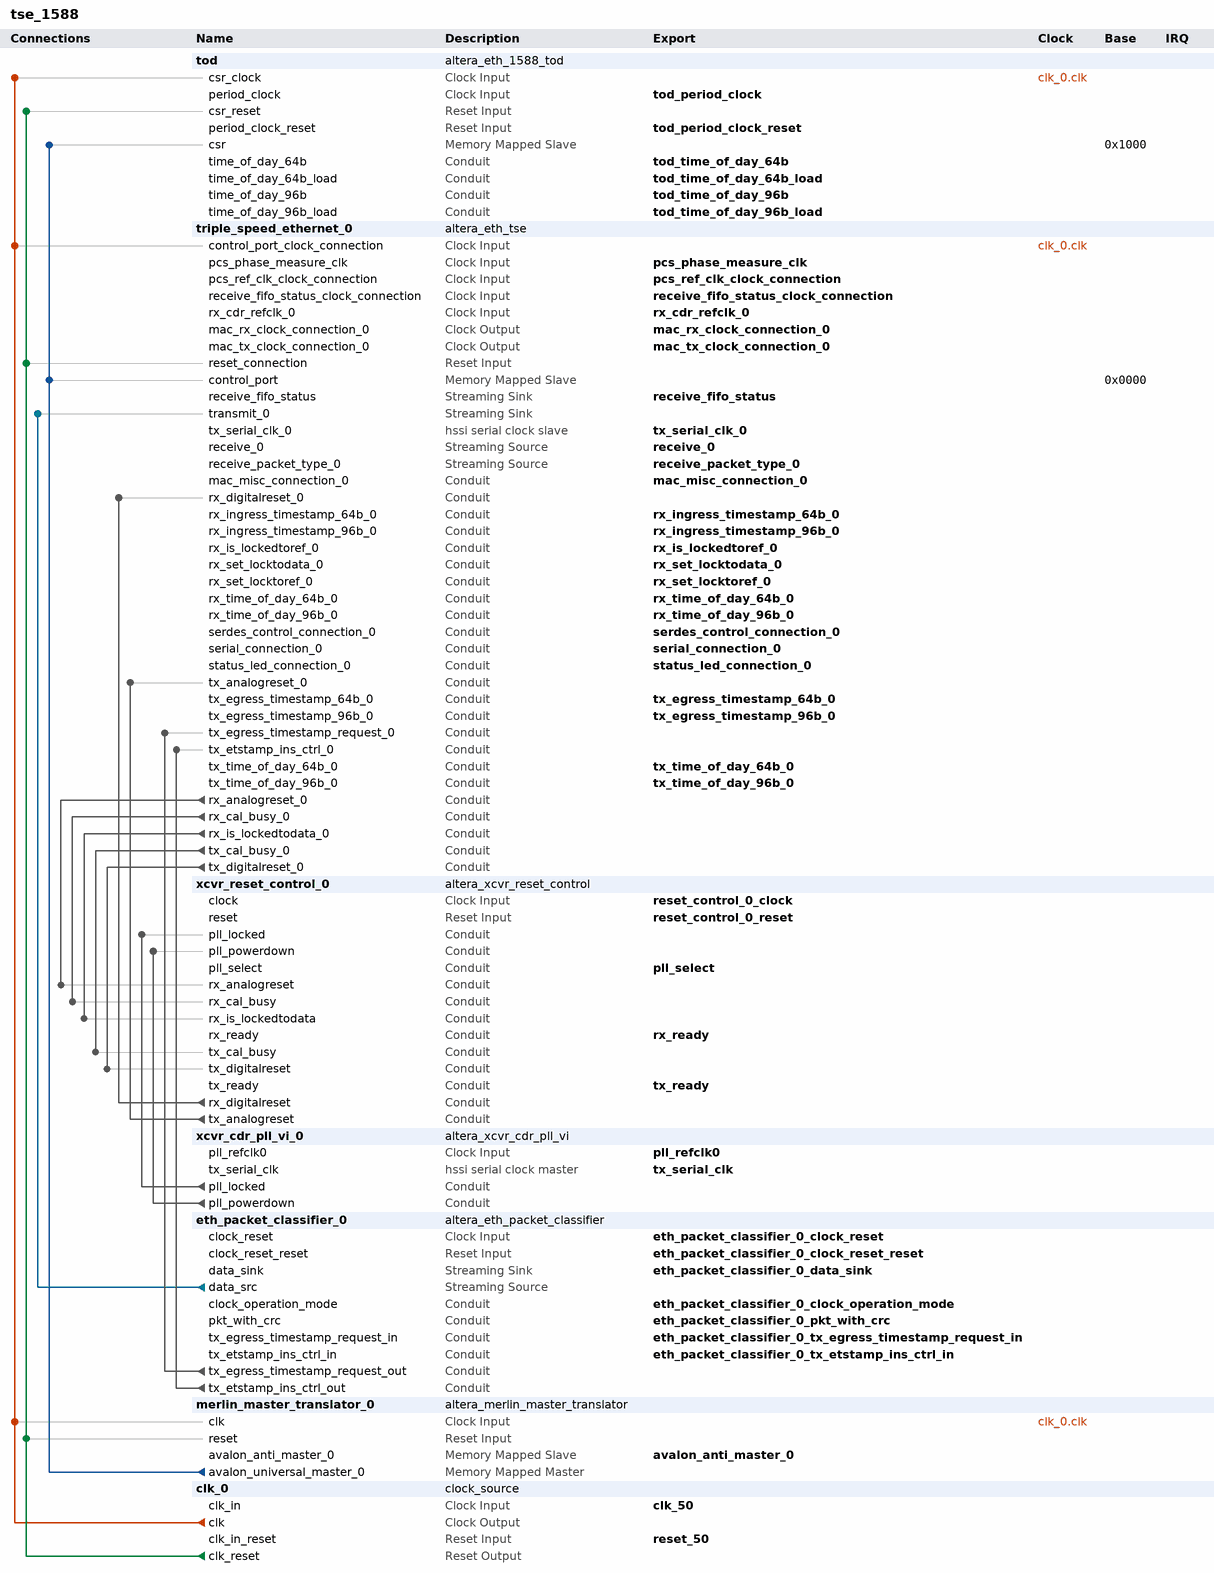
[diagram p0: system contents]
# Platform Designer (Qsys) system tse_1588, Arria 10 Unknown
# Parameters at their usual value, and those the tool derives, are not listed.
package require -exact qsys 13.1
create_system tse_1588
set_project_property DEVICE_FAMILY {Arria 10}
set_project_property DEVICE Unknown

add_instance tod altera_eth_1588_tod 13.1
set_instance_parameter_value tod DEFAULT_NSEC_PERIOD 8
set_instance_parameter_value tod DEFAULT_FNSEC_PERIOD 0
set_instance_parameter_value tod DEFAULT_NSEC_ADJPERIOD 8
set_instance_parameter_value tod DEFAULT_FNSEC_ADJPERIOD 0

add_instance triple_speed_ethernet_0 altera_eth_tse 13.1
set_instance_parameter_value triple_speed_ethernet_0 core_variation MAC_PCS
set_instance_parameter_value triple_speed_ethernet_0 ifGMII MII_GMII
set_instance_parameter_value triple_speed_ethernet_0 enable_use_internal_fifo false
set_instance_parameter_value triple_speed_ethernet_0 transceiver_type GXB
set_instance_parameter_value triple_speed_ethernet_0 enable_hd_logic true
set_instance_parameter_value triple_speed_ethernet_0 stat_cnt_ena true
set_instance_parameter_value triple_speed_ethernet_0 enable_shift16 false
set_instance_parameter_value triple_speed_ethernet_0 enable_mac_flow_ctrl true
set_instance_parameter_value triple_speed_ethernet_0 enable_magic_detect false
set_instance_parameter_value triple_speed_ethernet_0 useMDIO false
set_instance_parameter_value triple_speed_ethernet_0 mdio_clk_div 40
set_instance_parameter_value triple_speed_ethernet_0 ing_addr 11
set_instance_parameter_value triple_speed_ethernet_0 enable_sgmii true
set_instance_parameter_value triple_speed_ethernet_0 enable_timestamping true
set_instance_parameter_value triple_speed_ethernet_0 enable_ptp_1step true

add_instance xcvr_reset_control_0 altera_xcvr_reset_control 13.1
set_instance_parameter_value xcvr_reset_control_0 CHANNELS 1
set_instance_parameter_value xcvr_reset_control_0 SYS_CLK_IN_MHZ 125
set_instance_parameter_value xcvr_reset_control_0 TX_PLL_ENABLE 1
set_instance_parameter_value xcvr_reset_control_0 gui_tx_auto_reset 1
set_instance_parameter_value xcvr_reset_control_0 T_TX_DIGITALRESET 20
set_instance_parameter_value xcvr_reset_control_0 RX_PER_CHANNEL 0
set_instance_parameter_value xcvr_reset_control_0 T_RX_ANALOGRESET 40

add_instance xcvr_cdr_pll_vi_0 altera_xcvr_cdr_pll_vi 13.1
set_instance_parameter_value xcvr_cdr_pll_vi_0 rcfg_debug 0
set_instance_parameter_value xcvr_cdr_pll_vi_0 enable_pll_reconfig 0
set_instance_parameter_value xcvr_cdr_pll_vi_0 rcfg_file_prefix altera_xcvr_cdr_pll_vi
set_instance_parameter_value xcvr_cdr_pll_vi_0 rcfg_sv_file_enable 0
set_instance_parameter_value xcvr_cdr_pll_vi_0 rcfg_h_file_enable 0
set_instance_parameter_value xcvr_cdr_pll_vi_0 rcfg_txt_file_enable 0
set_instance_parameter_value xcvr_cdr_pll_vi_0 rcfg_mif_file_enable 0
set_instance_parameter_value xcvr_cdr_pll_vi_0 rcfg_multi_enable 0
set_instance_parameter_value xcvr_cdr_pll_vi_0 rcfg_profile_cnt 2
set_instance_parameter_value xcvr_cdr_pll_vi_0 rcfg_profile_select 1
set_instance_parameter_value xcvr_cdr_pll_vi_0 generate_docs 1
set_instance_parameter_value xcvr_cdr_pll_vi_0 generate_add_hdl_instance_example 0
set_instance_parameter_value xcvr_cdr_pll_vi_0 device_family {Arria 10}
set_instance_parameter_value xcvr_cdr_pll_vi_0 speed_grade dash2
set_instance_parameter_value xcvr_cdr_pll_vi_0 prot_mode basic_rx
set_instance_parameter_value xcvr_cdr_pll_vi_0 bw_sel low
set_instance_parameter_value xcvr_cdr_pll_vi_0 refclk_cnt 1
set_instance_parameter_value xcvr_cdr_pll_vi_0 refclk_index 0
set_instance_parameter_value xcvr_cdr_pll_vi_0 silicon_rev reva
set_instance_parameter_value xcvr_cdr_pll_vi_0 message_level error
set_instance_parameter_value xcvr_cdr_pll_vi_0 support_mode user_mode
set_instance_parameter_value xcvr_cdr_pll_vi_0 select_manual_config false
set_instance_parameter_value xcvr_cdr_pll_vi_0 output_clock_frequency 1250
set_instance_parameter_value xcvr_cdr_pll_vi_0 reference_clock_frequency 125.000000
set_instance_parameter_value xcvr_cdr_pll_vi_0 cdr_pll_pma_width 8
set_instance_parameter_value xcvr_cdr_pll_vi_0 cdr_pll_cgb_div 1
set_instance_parameter_value xcvr_cdr_pll_vi_0 cdr_pll_txpll_hclk_driver_enable false
set_instance_parameter_value xcvr_cdr_pll_vi_0 cdr_pll_fb_select direct_fb
set_instance_parameter_value xcvr_cdr_pll_vi_0 cdr_pll_atb_select_control atb_off
set_instance_parameter_value xcvr_cdr_pll_vi_0 cdr_pll_bbpd_data_pattern_filter_select bbpd_data_pat_off
set_instance_parameter_value xcvr_cdr_pll_vi_0 cdr_pll_cdr_odi_select sel_cdr
set_instance_parameter_value xcvr_cdr_pll_vi_0 cdr_pll_chgpmp_current_pd cp_current_pd_setting0
set_instance_parameter_value xcvr_cdr_pll_vi_0 cdr_pll_chgpmp_current_pfd cp_current_pfd_setting0
set_instance_parameter_value xcvr_cdr_pll_vi_0 cdr_pll_chgpmp_replicate true
set_instance_parameter_value xcvr_cdr_pll_vi_0 cdr_pll_chgpmp_testmode cp_test_disable
set_instance_parameter_value xcvr_cdr_pll_vi_0 cdr_pll_clklow_mux_select clklow_mux_cdr_fbclk
set_instance_parameter_value xcvr_cdr_pll_vi_0 cdr_pll_diag_loopback_enable false
set_instance_parameter_value xcvr_cdr_pll_vi_0 cdr_pll_disable_up_dn true
set_instance_parameter_value xcvr_cdr_pll_vi_0 cdr_pll_fref_clklow_div 1
set_instance_parameter_value xcvr_cdr_pll_vi_0 cdr_pll_fref_mux_select fref_mux_cdr_refclk
set_instance_parameter_value xcvr_cdr_pll_vi_0 cdr_pll_gpon_lck2ref_control gpon_lck2ref_off
set_instance_parameter_value xcvr_cdr_pll_vi_0 cdr_pll_lck2ref_delay_control lck2ref_delay_off
set_instance_parameter_value xcvr_cdr_pll_vi_0 cdr_pll_lf_resistor_pd lf_pd_setting0
set_instance_parameter_value xcvr_cdr_pll_vi_0 cdr_pll_lf_resistor_pfd lf_pfd_setting0
set_instance_parameter_value xcvr_cdr_pll_vi_0 cdr_pll_lf_ripple_cap lf_no_ripple
set_instance_parameter_value xcvr_cdr_pll_vi_0 cdr_pll_loop_filter_bias_select lpflt_bias_off
set_instance_parameter_value xcvr_cdr_pll_vi_0 cdr_pll_loopback_mode loopback_disabled
set_instance_parameter_value xcvr_cdr_pll_vi_0 cdr_pll_ltd_ltr_micro_controller_select ltd_ltr_pcs
set_instance_parameter_value xcvr_cdr_pll_vi_0 cdr_pll_op_mode pwr_down
set_instance_parameter_value xcvr_cdr_pll_vi_0 cdr_pll_pd_fastlock_mode false
set_instance_parameter_value xcvr_cdr_pll_vi_0 cdr_pll_power_mode low_power
set_instance_parameter_value xcvr_cdr_pll_vi_0 cdr_pll_reverse_serial_loopback no_loopback
set_instance_parameter_value xcvr_cdr_pll_vi_0 cdr_pll_set_cdr_v2i_enable true
set_instance_parameter_value xcvr_cdr_pll_vi_0 cdr_pll_set_cdr_vco_reset false
set_instance_parameter_value xcvr_cdr_pll_vi_0 cdr_pll_set_cdr_vco_speed cdr_vco_max_speedbin
set_instance_parameter_value xcvr_cdr_pll_vi_0 cdr_pll_set_cdr_vco_speed_pciegen3 cdr_vco_max_speedbin_pciegen3
set_instance_parameter_value xcvr_cdr_pll_vi_0 cdr_pll_vco_overrange_voltage vco_overrange_off
set_instance_parameter_value xcvr_cdr_pll_vi_0 cdr_pll_vco_underrange_voltage vco_underange_off
set_instance_parameter_value xcvr_cdr_pll_vi_0 cdr_pll_is_cascaded_pll false
set_instance_parameter_value xcvr_cdr_pll_vi_0 cdr_pll_device_variant device1
set_instance_parameter_value xcvr_cdr_pll_vi_0 cdr_pll_optimal true
set_instance_parameter_value xcvr_cdr_pll_vi_0 cdr_pll_position position_unknown
set_instance_parameter_value xcvr_cdr_pll_vi_0 cdr_pll_primary_use cmu
set_instance_parameter_value xcvr_cdr_pll_vi_0 cdr_pll_side side_unknown
set_instance_parameter_value xcvr_cdr_pll_vi_0 cdr_pll_sup_mode user_mode
set_instance_parameter_value xcvr_cdr_pll_vi_0 cdr_pll_top_or_bottom tb_unknown
set_instance_parameter_value xcvr_cdr_pll_vi_0 pma_cdr_refclk_select_mux_inclk0_logical_to_physical_mapping ref_iqclk0
set_instance_parameter_value xcvr_cdr_pll_vi_0 pma_cdr_refclk_select_mux_inclk1_logical_to_physical_mapping ref_iqclk1
set_instance_parameter_value xcvr_cdr_pll_vi_0 pma_cdr_refclk_select_mux_inclk2_logical_to_physical_mapping ref_iqclk2
set_instance_parameter_value xcvr_cdr_pll_vi_0 pma_cdr_refclk_select_mux_inclk3_logical_to_physical_mapping ref_iqclk3
set_instance_parameter_value xcvr_cdr_pll_vi_0 pma_cdr_refclk_select_mux_inclk4_logical_to_physical_mapping ref_iqclk4

add_instance eth_packet_classifier_0 altera_eth_packet_classifier 13.1
set_instance_parameter_value eth_packet_classifier_0 TSTAMP_FP_WIDTH 4
set_instance_parameter_value eth_packet_classifier_0 SYMBOLSPERBEAT 1
set_instance_parameter_value eth_packet_classifier_0 BITSPERSYMBOL 8

add_instance merlin_master_translator_0 altera_merlin_master_translator 13.1
set_instance_parameter_value merlin_master_translator_0 AV_ADDRESS_W 32
set_instance_parameter_value merlin_master_translator_0 AV_DATA_W 32
set_instance_parameter_value merlin_master_translator_0 AV_BURSTCOUNT_W 3
set_instance_parameter_value merlin_master_translator_0 AV_BYTEENABLE_W 4
set_instance_parameter_value merlin_master_translator_0 UAV_ADDRESS_W 32
set_instance_parameter_value merlin_master_translator_0 UAV_BURSTCOUNT_W 3
set_instance_parameter_value merlin_master_translator_0 AV_READLATENCY 0
set_instance_parameter_value merlin_master_translator_0 AV_WRITE_WAIT 0
set_instance_parameter_value merlin_master_translator_0 AV_READ_WAIT 0
set_instance_parameter_value merlin_master_translator_0 AV_DATA_HOLD 0
set_instance_parameter_value merlin_master_translator_0 AV_SETUP_WAIT 0
set_instance_parameter_value merlin_master_translator_0 USE_READDATA 1
set_instance_parameter_value merlin_master_translator_0 USE_WRITEDATA 1
set_instance_parameter_value merlin_master_translator_0 USE_READ 1
set_instance_parameter_value merlin_master_translator_0 USE_WRITE 1
set_instance_parameter_value merlin_master_translator_0 USE_BEGINBURSTTRANSFER 0
set_instance_parameter_value merlin_master_translator_0 USE_BEGINTRANSFER 0
set_instance_parameter_value merlin_master_translator_0 USE_BYTEENABLE 0
set_instance_parameter_value merlin_master_translator_0 USE_CHIPSELECT 0
set_instance_parameter_value merlin_master_translator_0 USE_ADDRESS 1
set_instance_parameter_value merlin_master_translator_0 USE_BURSTCOUNT 0
set_instance_parameter_value merlin_master_translator_0 USE_DEBUGACCESS 0
set_instance_parameter_value merlin_master_translator_0 USE_CLKEN 0
set_instance_parameter_value merlin_master_translator_0 USE_READDATAVALID 0
set_instance_parameter_value merlin_master_translator_0 USE_WAITREQUEST 1
set_instance_parameter_value merlin_master_translator_0 USE_LOCK 0
set_instance_parameter_value merlin_master_translator_0 USE_READRESPONSE 0
set_instance_parameter_value merlin_master_translator_0 USE_WRITERESPONSE 0
set_instance_parameter_value merlin_master_translator_0 AV_SYMBOLS_PER_WORD 4
set_instance_parameter_value merlin_master_translator_0 AV_ADDRESS_SYMBOLS 1
set_instance_parameter_value merlin_master_translator_0 AV_BURSTCOUNT_SYMBOLS 1
set_instance_parameter_value merlin_master_translator_0 AV_CONSTANT_BURST_BEHAVIOR 0
set_instance_parameter_value merlin_master_translator_0 UAV_CONSTANT_BURST_BEHAVIOR 0
set_instance_parameter_value merlin_master_translator_0 AV_LINEWRAPBURSTS 0
set_instance_parameter_value merlin_master_translator_0 AV_MAX_PENDING_READ_TRANSACTIONS 64
set_instance_parameter_value merlin_master_translator_0 AV_BURSTBOUNDARIES 0
set_instance_parameter_value merlin_master_translator_0 AV_INTERLEAVEBURSTS 0
set_instance_parameter_value merlin_master_translator_0 AV_BITS_PER_SYMBOL 8
set_instance_parameter_value merlin_master_translator_0 AV_ISBIGENDIAN 0
set_instance_parameter_value merlin_master_translator_0 AV_ADDRESSGROUP 0
set_instance_parameter_value merlin_master_translator_0 UAV_ADDRESSGROUP 0
set_instance_parameter_value merlin_master_translator_0 AV_REGISTEROUTGOINGSIGNALS 0
set_instance_parameter_value merlin_master_translator_0 AV_REGISTERINCOMINGSIGNALS 0
set_instance_parameter_value merlin_master_translator_0 AV_ALWAYSBURSTMAXBURST 0

add_instance clk_0 clock_source 13.1
set_instance_parameter_value clk_0 clockFrequency 50000000

# connections
add_connection clk_0.clk merlin_master_translator_0.clk clock
add_connection clk_0.clk tod.csr_clock clock
add_connection clk_0.clk triple_speed_ethernet_0.control_port_clock_connection clock
add_connection clk_0.clk_reset merlin_master_translator_0.reset reset
add_connection clk_0.clk_reset tod.csr_reset reset
add_connection clk_0.clk_reset triple_speed_ethernet_0.reset_connection reset
add_connection merlin_master_translator_0.avalon_universal_master_0 tod.csr avalon
set_connection_parameter_value merlin_master_translator_0.avalon_universal_master_0/tod.csr baseAddress 0x1000
add_connection merlin_master_translator_0.avalon_universal_master_0 triple_speed_ethernet_0.control_port avalon
set_connection_parameter_value merlin_master_translator_0.avalon_universal_master_0/triple_speed_ethernet_0.control_port baseAddress 0x0000
add_connection eth_packet_classifier_0.data_src triple_speed_ethernet_0.transmit_0 avalon_streaming
add_connection eth_packet_classifier_0.tx_egress_timestamp_request_out triple_speed_ethernet_0.tx_egress_timestamp_request_0 conduit
add_connection eth_packet_classifier_0.tx_etstamp_ins_ctrl_out triple_speed_ethernet_0.tx_etstamp_ins_ctrl_0 conduit
add_connection triple_speed_ethernet_0.rx_analogreset_0 xcvr_reset_control_0.rx_analogreset conduit
add_connection triple_speed_ethernet_0.rx_cal_busy_0 xcvr_reset_control_0.rx_cal_busy conduit
add_connection triple_speed_ethernet_0.rx_is_lockedtodata_0 xcvr_reset_control_0.rx_is_lockedtodata conduit
add_connection triple_speed_ethernet_0.tx_cal_busy_0 xcvr_reset_control_0.tx_cal_busy conduit
add_connection triple_speed_ethernet_0.tx_digitalreset_0 xcvr_reset_control_0.tx_digitalreset conduit
add_connection xcvr_cdr_pll_vi_0.pll_locked xcvr_reset_control_0.pll_locked conduit
add_connection xcvr_cdr_pll_vi_0.pll_powerdown xcvr_reset_control_0.pll_powerdown conduit
add_connection xcvr_reset_control_0.rx_digitalreset triple_speed_ethernet_0.rx_digitalreset_0 conduit
add_connection xcvr_reset_control_0.tx_analogreset triple_speed_ethernet_0.tx_analogreset_0 conduit

# exported interfaces
add_interface tod_period_clock clock sink
set_interface_property tod_period_clock EXPORT_OF tod.period_clock
add_interface tod_period_clock_reset reset sink
set_interface_property tod_period_clock_reset EXPORT_OF tod.period_clock_reset
add_interface receive_fifo_status_clock_connection clock sink
set_interface_property receive_fifo_status_clock_connection EXPORT_OF triple_speed_ethernet_0.receive_fifo_status_clock_connection
add_interface receive_fifo_status avalon_streaming sink
set_interface_property receive_fifo_status EXPORT_OF triple_speed_ethernet_0.receive_fifo_status
add_interface mac_rx_clock_connection_0 clock source
set_interface_property mac_rx_clock_connection_0 EXPORT_OF triple_speed_ethernet_0.mac_rx_clock_connection_0
add_interface mac_tx_clock_connection_0 clock source
set_interface_property mac_tx_clock_connection_0 EXPORT_OF triple_speed_ethernet_0.mac_tx_clock_connection_0
add_interface receive_0 avalon_streaming source
set_interface_property receive_0 EXPORT_OF triple_speed_ethernet_0.receive_0
add_interface receive_packet_type_0 avalon_streaming source
set_interface_property receive_packet_type_0 EXPORT_OF triple_speed_ethernet_0.receive_packet_type_0
add_interface rx_ingress_timestamp_96b_0 conduit end
set_interface_property rx_ingress_timestamp_96b_0 EXPORT_OF triple_speed_ethernet_0.rx_ingress_timestamp_96b_0
add_interface rx_ingress_timestamp_64b_0 conduit end
set_interface_property rx_ingress_timestamp_64b_0 EXPORT_OF triple_speed_ethernet_0.rx_ingress_timestamp_64b_0
add_interface tx_egress_timestamp_96b_0 conduit end
set_interface_property tx_egress_timestamp_96b_0 EXPORT_OF triple_speed_ethernet_0.tx_egress_timestamp_96b_0
add_interface tx_egress_timestamp_64b_0 conduit end
set_interface_property tx_egress_timestamp_64b_0 EXPORT_OF triple_speed_ethernet_0.tx_egress_timestamp_64b_0
add_interface pcs_phase_measure_clk clock sink
set_interface_property pcs_phase_measure_clk EXPORT_OF triple_speed_ethernet_0.pcs_phase_measure_clk
add_interface mac_misc_connection_0 conduit end
set_interface_property mac_misc_connection_0 EXPORT_OF triple_speed_ethernet_0.mac_misc_connection_0
add_interface pcs_ref_clk_clock_connection clock sink
set_interface_property pcs_ref_clk_clock_connection EXPORT_OF triple_speed_ethernet_0.pcs_ref_clk_clock_connection
add_interface status_led_connection_0 conduit end
set_interface_property status_led_connection_0 EXPORT_OF triple_speed_ethernet_0.status_led_connection_0
add_interface serdes_control_connection_0 conduit end
set_interface_property serdes_control_connection_0 EXPORT_OF triple_speed_ethernet_0.serdes_control_connection_0
add_interface serial_connection_0 conduit end
set_interface_property serial_connection_0 EXPORT_OF triple_speed_ethernet_0.serial_connection_0
add_interface tod_time_of_day_96b_load conduit end
set_interface_property tod_time_of_day_96b_load EXPORT_OF tod.time_of_day_96b_load
add_interface tod_time_of_day_64b_load conduit end
set_interface_property tod_time_of_day_64b_load EXPORT_OF tod.time_of_day_64b_load
add_interface reset_control_0_clock clock sink
set_interface_property reset_control_0_clock EXPORT_OF xcvr_reset_control_0.clock
add_interface rx_set_locktodata_0 conduit end
set_interface_property rx_set_locktodata_0 EXPORT_OF triple_speed_ethernet_0.rx_set_locktodata_0
add_interface rx_set_locktoref_0 conduit end
set_interface_property rx_set_locktoref_0 EXPORT_OF triple_speed_ethernet_0.rx_set_locktoref_0
add_interface rx_is_lockedtoref_0 conduit end
set_interface_property rx_is_lockedtoref_0 EXPORT_OF triple_speed_ethernet_0.rx_is_lockedtoref_0
add_interface tx_ready conduit end
set_interface_property tx_ready EXPORT_OF xcvr_reset_control_0.tx_ready
add_interface pll_select conduit end
set_interface_property pll_select EXPORT_OF xcvr_reset_control_0.pll_select
add_interface rx_ready conduit end
set_interface_property rx_ready EXPORT_OF xcvr_reset_control_0.rx_ready
add_interface pll_refclk0 clock sink
set_interface_property pll_refclk0 EXPORT_OF xcvr_cdr_pll_vi_0.pll_refclk0
add_interface tx_serial_clk hssi_serial_clock start
set_interface_property tx_serial_clk EXPORT_OF xcvr_cdr_pll_vi_0.tx_serial_clk
add_interface tx_serial_clk_0 hssi_serial_clock end
set_interface_property tx_serial_clk_0 EXPORT_OF triple_speed_ethernet_0.tx_serial_clk_0
add_interface rx_cdr_refclk_0 clock sink
set_interface_property rx_cdr_refclk_0 EXPORT_OF triple_speed_ethernet_0.rx_cdr_refclk_0
add_interface reset_control_0_reset reset sink
set_interface_property reset_control_0_reset EXPORT_OF xcvr_reset_control_0.reset
add_interface clk_50 clock sink
set_interface_property clk_50 EXPORT_OF clk_0.clk_in
add_interface reset_50 reset sink
set_interface_property reset_50 EXPORT_OF clk_0.clk_in_reset
add_interface tod_time_of_day_96b conduit end
set_interface_property tod_time_of_day_96b EXPORT_OF tod.time_of_day_96b
add_interface tod_time_of_day_64b conduit end
set_interface_property tod_time_of_day_64b EXPORT_OF tod.time_of_day_64b
add_interface avalon_anti_master_0 avalon slave
set_interface_property avalon_anti_master_0 EXPORT_OF merlin_master_translator_0.avalon_anti_master_0
add_interface eth_packet_classifier_0_clock_reset clock sink
set_interface_property eth_packet_classifier_0_clock_reset EXPORT_OF eth_packet_classifier_0.clock_reset
add_interface eth_packet_classifier_0_clock_reset_reset reset sink
set_interface_property eth_packet_classifier_0_clock_reset_reset EXPORT_OF eth_packet_classifier_0.clock_reset_reset
add_interface eth_packet_classifier_0_data_sink avalon_streaming sink
set_interface_property eth_packet_classifier_0_data_sink EXPORT_OF eth_packet_classifier_0.data_sink
add_interface eth_packet_classifier_0_clock_operation_mode conduit end
set_interface_property eth_packet_classifier_0_clock_operation_mode EXPORT_OF eth_packet_classifier_0.clock_operation_mode
add_interface eth_packet_classifier_0_pkt_with_crc conduit end
set_interface_property eth_packet_classifier_0_pkt_with_crc EXPORT_OF eth_packet_classifier_0.pkt_with_crc
add_interface eth_packet_classifier_0_tx_egress_timestamp_request_in conduit end
set_interface_property eth_packet_classifier_0_tx_egress_timestamp_request_in EXPORT_OF eth_packet_classifier_0.tx_egress_timestamp_request_in
add_interface eth_packet_classifier_0_tx_etstamp_ins_ctrl_in conduit end
set_interface_property eth_packet_classifier_0_tx_etstamp_ins_ctrl_in EXPORT_OF eth_packet_classifier_0.tx_etstamp_ins_ctrl_in
add_interface rx_time_of_day_96b_0 conduit end
set_interface_property rx_time_of_day_96b_0 EXPORT_OF triple_speed_ethernet_0.rx_time_of_day_96b_0
add_interface rx_time_of_day_64b_0 conduit end
set_interface_property rx_time_of_day_64b_0 EXPORT_OF triple_speed_ethernet_0.rx_time_of_day_64b_0
add_interface tx_time_of_day_96b_0 conduit end
set_interface_property tx_time_of_day_96b_0 EXPORT_OF triple_speed_ethernet_0.tx_time_of_day_96b_0
add_interface tx_time_of_day_64b_0 conduit end
set_interface_property tx_time_of_day_64b_0 EXPORT_OF triple_speed_ethernet_0.tx_time_of_day_64b_0

set_interconnect_requirement {$system} qsys_mm.clockCrossingAdapter HANDSHAKE
set_interconnect_requirement {$system} qsys_mm.maxAdditionalLatency 1

save_system tse_1588.qsys
